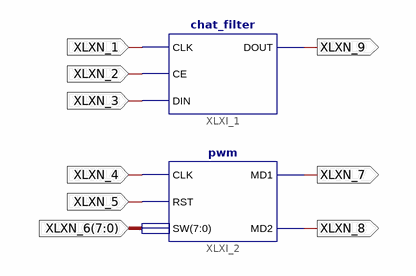
[diagram p0: schematic sheet 1]
// Xilinx ISE schematic main.sch (spartan6) as structural Verilog: 2 symbols, 9 ports
module main (
  input  XLXN_1,
  input  XLXN_2,
  input  XLXN_3,
  input  XLXN_4,
  input  XLXN_5,
  input  [7:0] XLXN_6,
  output XLXN_7,
  output XLXN_8,
  output XLXN_9
);

  chat_filter XLXI_1 (.CLK(XLXN_1), .CE(XLXN_2), .DIN(XLXN_3), .DOUT(XLXN_9));
  pwm XLXI_2 (.CLK(XLXN_4), .RST(XLXN_5), .SW(XLXN_6), .MD1(XLXN_7), .MD2(XLXN_8));
endmodule
